# EAGLE schematic p128necontrol (EAGLE 9.6.2)
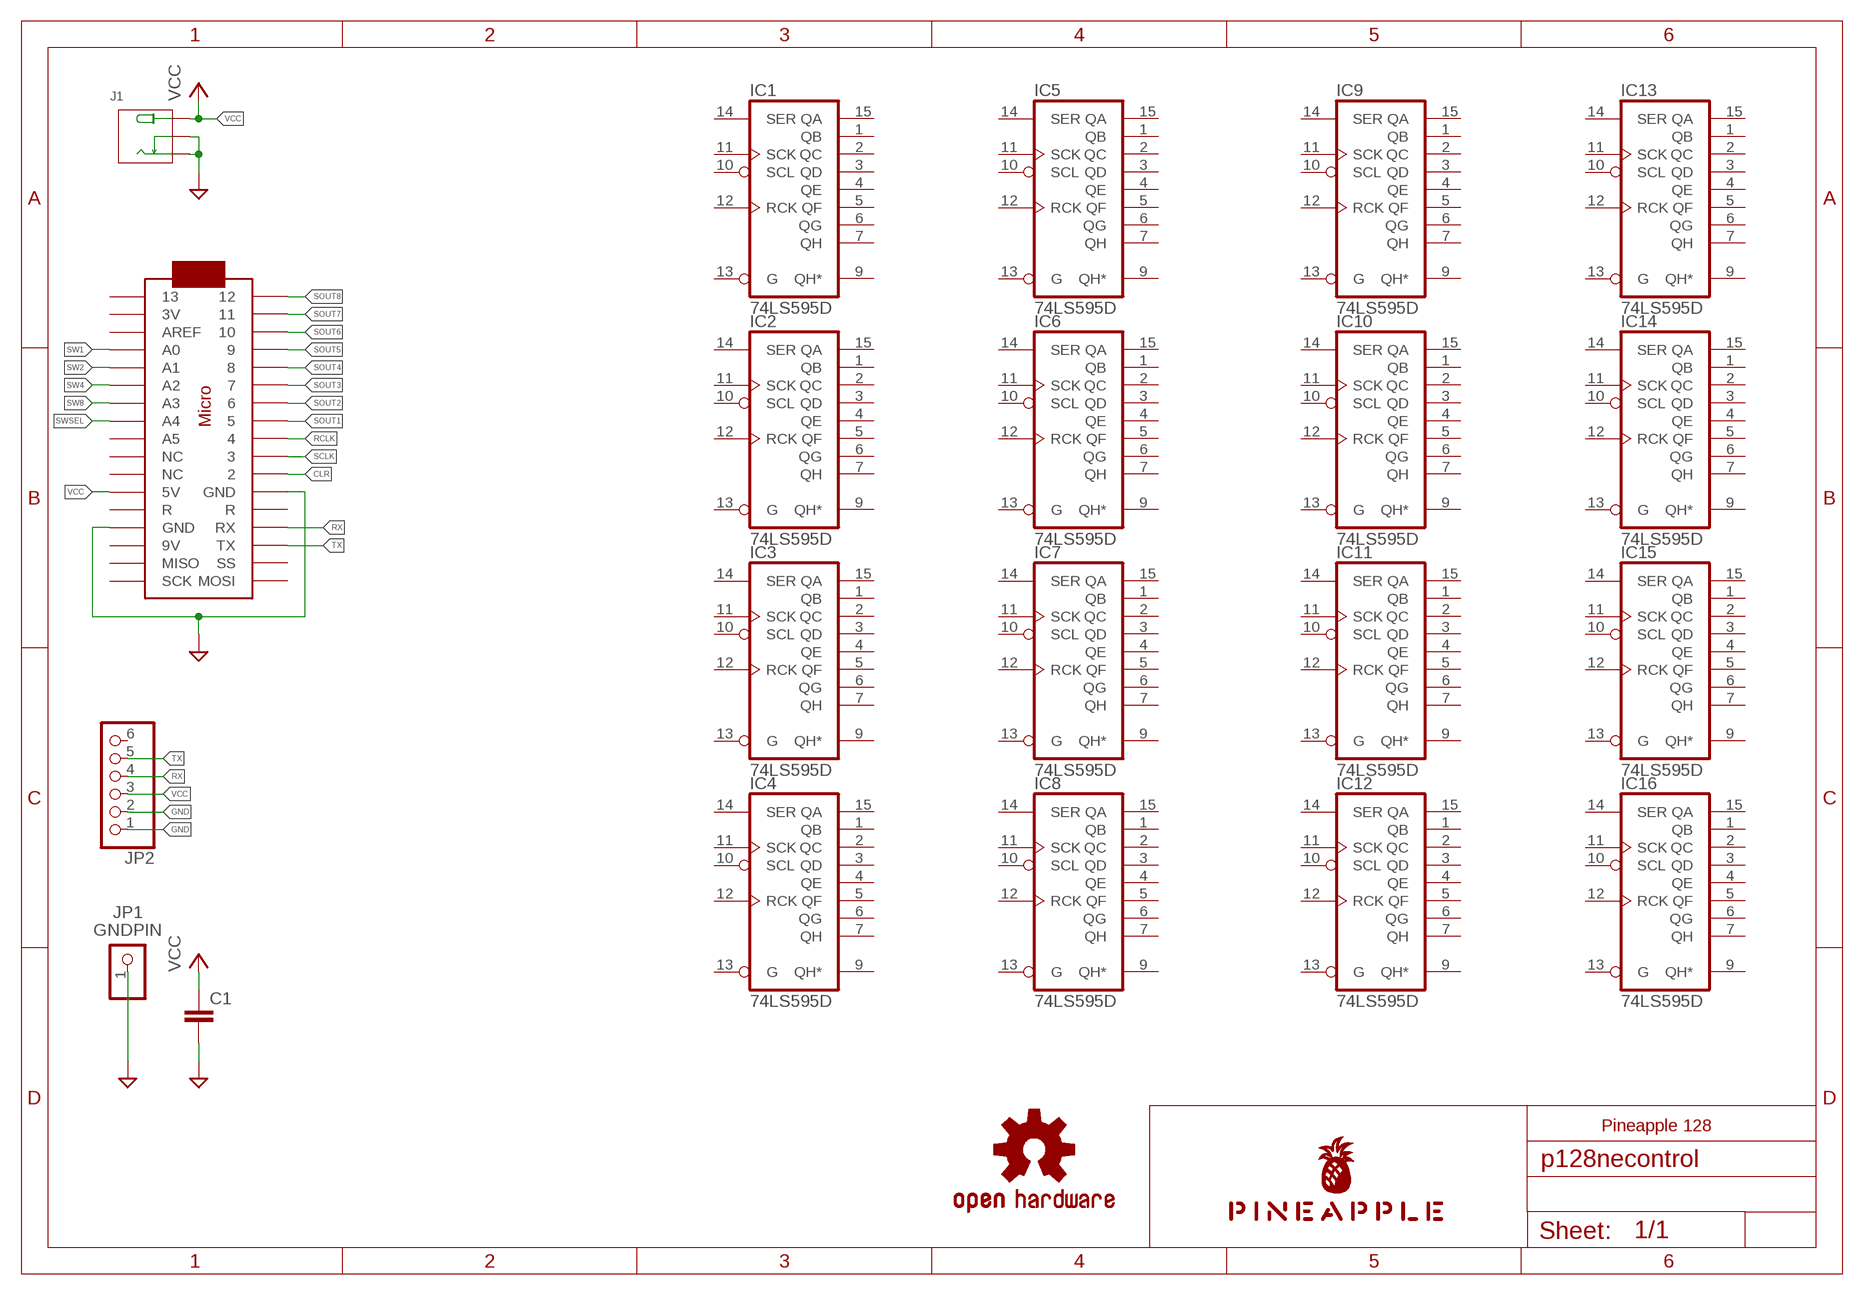
[diagram p0: schematic, sheet 1]

## Parts
C1  C-EU025-024X044  [C025-024X044]
IC1  74LS595D  [SO16]
IC2  74LS595D  [SO16]
IC3  74LS595D  [SO16]
IC4  74LS595D  [SO16]
IC5  74LS595D  [SO16]
IC6  74LS595D  [SO16]
IC7  74LS595D  [SO16]
IC8  74LS595D  [SO16]
IC9  74LS595D  [SO16]
IC10  74LS595D  [SO16]
IC11  74LS595D  [SO16]
IC12  74LS595D  [SO16]
IC13  74LS595D  [SO16]
IC14  74LS595D  [SO16]
IC15  74LS595D  [SO16]
IC16  74LS595D  [SO16]
J1  JACK-DC-005'DC-005'  [3P-L14.2*W11.0*H9.0MM]
JP1  GNDPIN  PINHD-1X1  [1X01]
JP2  PINHD-1X6  [1X06]
LOGO1  OSHW-LOGOS-COPPER  [OSHW-LOGO-S_COPPER]
U$1  PINEAPPLE450_SILK  [PINEAPPLE450_SILK]
U$2  ARDUINOMICRO  [ARDUINOMICRO]

## Nets
CLR: U$2.P$11
GND [gnd]: C1.2 J1.-1(-) J1.-2(CDN) JP1.1 JP2.1 JP2.2 U$2.P$12(GND) U$2.P$21(GND)
RCLK: U$2.P$9
RX: JP2.4 U$2.P$14(RX)
SCLK: U$2.P$10
SOUT1: U$2.P$8
SOUT2: U$2.P$7
SOUT3: U$2.P$6
SOUT4: U$2.P$5
SOUT5: U$2.P$4
SOUT6: U$2.P$3
SOUT7: U$2.P$2
SOUT8: U$2.P$1
SW1: U$2.P$31(A0)
SW2: U$2.P$30(A1)
SW4: U$2.P$29(A2)
SW8: U$2.P$28(A3)
SWSEL: U$2.P$27(A4)
TX: JP2.5 U$2.P$15(TX)
VCC [power]: C1.1 J1.+ JP2.3 U$2.P$23(5V)
Unconnected: IC1.1(QB) IC1.2(QC) IC1.3(QD) IC1.4(QE) IC1.5(QF) IC1.6(QG) IC1.7(QH) IC1.9(QH*) IC1.10(SCL) IC1.11(SCK) IC1.12(RCK) IC1.13(G) IC1.14(SER) IC1.15(QA) IC2.1(QB) IC2.2(QC) IC2.3(QD) IC2.4(QE) IC2.5(QF) IC2.6(QG) IC2.7(QH) IC2.9(QH*) IC2.10(SCL) IC2.11(SCK) IC2.12(RCK) IC2.13(G) IC2.14(SER) IC2.15(QA) IC3.1(QB) IC3.2(QC) IC3.3(QD) IC3.4(QE) IC3.5(QF) IC3.6(QG) IC3.7(QH) IC3.9(QH*) IC3.10(SCL) IC3.11(SCK) IC3.12(RCK) IC3.13(G) IC3.14(SER) IC3.15(QA) IC4.1(QB) IC4.2(QC) IC4.3(QD) IC4.4(QE) IC4.5(QF) IC4.6(QG) IC4.7(QH) IC4.9(QH*) IC4.10(SCL) IC4.11(SCK) IC4.12(RCK) IC4.13(G) IC4.14(SER) IC4.15(QA) IC5.1(QB) IC5.2(QC) IC5.3(QD) IC5.4(QE) IC5.5(QF) IC5.6(QG) IC5.7(QH) IC5.9(QH*) IC5.10(SCL) IC5.11(SCK) IC5.12(RCK) IC5.13(G) IC5.14(SER) IC5.15(QA) IC6.1(QB) IC6.2(QC) IC6.3(QD) IC6.4(QE) IC6.5(QF) IC6.6(QG) IC6.7(QH) IC6.9(QH*) IC6.10(SCL) IC6.11(SCK) IC6.12(RCK) IC6.13(G) IC6.14(SER) IC6.15(QA) IC7.1(QB) IC7.2(QC) IC7.3(QD) IC7.4(QE) IC7.5(QF) IC7.6(QG) IC7.7(QH) IC7.9(QH*) IC7.10(SCL) IC7.11(SCK) IC7.12(RCK) IC7.13(G) IC7.14(SER) IC7.15(QA) IC8.1(QB) IC8.2(QC) IC8.3(QD) IC8.4(QE) IC8.5(QF) IC8.6(QG) IC8.7(QH) IC8.9(QH*) IC8.10(SCL) IC8.11(SCK) IC8.12(RCK) IC8.13(G) IC8.14(SER) IC8.15(QA) IC9.1(QB) IC9.2(QC) IC9.3(QD) IC9.4(QE) IC9.5(QF) IC9.6(QG) IC9.7(QH) IC9.9(QH*) IC9.10(SCL) IC9.11(SCK) IC9.12(RCK) IC9.13(G) IC9.14(SER) IC9.15(QA) IC10.1(QB) IC10.2(QC) IC10.3(QD) IC10.4(QE) IC10.5(QF) IC10.6(QG) IC10.7(QH) IC10.9(QH*) IC10.10(SCL) IC10.11(SCK) IC10.12(RCK) IC10.13(G) IC10.14(SER) IC10.15(QA) IC11.1(QB) IC11.2(QC) IC11.3(QD) IC11.4(QE) IC11.5(QF) IC11.6(QG) IC11.7(QH) IC11.9(QH*) IC11.10(SCL) IC11.11(SCK) IC11.12(RCK) IC11.13(G) IC11.14(SER) IC11.15(QA) IC12.1(QB) IC12.2(QC) IC12.3(QD) IC12.4(QE) IC12.5(QF) IC12.6(QG) IC12.7(QH) IC12.9(QH*) IC12.10(SCL) IC12.11(SCK) IC12.12(RCK) IC12.13(G) IC12.14(SER) IC12.15(QA) IC13.1(QB) IC13.2(QC) IC13.3(QD) IC13.4(QE) IC13.5(QF) IC13.6(QG) IC13.7(QH) IC13.9(QH*) IC13.10(SCL) IC13.11(SCK) IC13.12(RCK) IC13.13(G) IC13.14(SER) IC13.15(QA) IC14.1(QB) IC14.2(QC) IC14.3(QD) IC14.4(QE) IC14.5(QF) IC14.6(QG) IC14.7(QH) IC14.9(QH*) IC14.10(SCL) IC14.11(SCK) IC14.12(RCK) IC14.13(G) IC14.14(SER) IC14.15(QA) IC15.1(QB) IC15.2(QC) IC15.3(QD) IC15.4(QE) IC15.5(QF) IC15.6(QG) IC15.7(QH) IC15.9(QH*) IC15.10(SCL) IC15.11(SCK) IC15.12(RCK) IC15.13(G) IC15.14(SER) IC15.15(QA) IC16.1(QB) IC16.2(QC) IC16.3(QD) IC16.4(QE) IC16.5(QF) IC16.6(QG) IC16.7(QH) IC16.9(QH*) IC16.10(SCL) IC16.11(SCK) IC16.12(RCK) IC16.13(G) IC16.14(SER) IC16.15(QA) JP2.6 U$2.P$13(R) U$2.P$16(SS) U$2.P$17(MOSI) U$2.P$18(SCK) U$2.P$19(MISO) U$2.P$20(9V) U$2.P$22(R) U$2.P$24(NC) U$2.P$25(NC) U$2.P$26(A5) U$2.P$32(AREF) U$2.P$33(3V) U$2.P$34

## Notes on the sheet
- Pineapple 128

## Power pins joined to a net without a drawn wire
GND: IC1.8(GND) IC2.8(GND) IC3.8(GND) IC4.8(GND) IC5.8(GND) IC6.8(GND) IC7.8(GND) IC8.8(GND) IC9.8(GND) IC10.8(GND) IC11.8(GND) IC12.8(GND) IC13.8(GND) IC14.8(GND) IC15.8(GND) IC16.8(GND)
VCC: IC1.16(VCC) IC2.16(VCC) IC3.16(VCC) IC4.16(VCC) IC5.16(VCC) IC6.16(VCC) IC7.16(VCC) IC8.16(VCC) IC9.16(VCC) IC10.16(VCC) IC11.16(VCC) IC12.16(VCC) IC13.16(VCC) IC14.16(VCC) IC15.16(VCC) IC16.16(VCC)

## Library data of the parts
C1 = resistor:C-EU: CAPACITOR, European symbol
IC1-IC16 = 74xx-us:74*595: 8-bit SHIFT REGISTER, output latch
J1 = Seeed-Connector:JACK-DC-005: 320120003
JP1 = pinhead:PINHD-1X1: PIN HEADER
JP2 = pinhead:PINHD-1X6: PIN HEADER
LOGO1 = SparkFun-Aesthetics:OSHW-LOGO: Open-Source Hardware (OSHW) Logo This logo indicates the piece of hardware it is found on incorporates a OSHW license and/or adheres to the definition of open source hardware found here: http://freedomdefined.org/OSHW
U$1 = pineapple:PINEAPPLE450_SILK
U$2 = adafruit:ARDUINOMICRO

## Net classes
0 default: width 0.152 mm, drill 0.152 mm, clearance 0.152 mm
1 gnd: width 0.61 mm, drill 0.152 mm, clearance 0.152 mm
2 power: width 0.61 mm, drill 0.152 mm, clearance 0.152 mm
3 analog: width 0.305 mm, drill 0.152 mm, clearance 0.152 mm